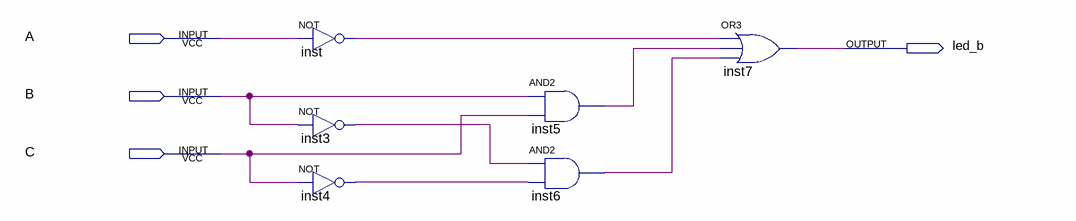
[diagram p0: schematic sheet]
// Quartus schematic led_b.bdf as structural Verilog: 6 symbols, 4 pins
module led_b (
  input  A,
  input  B,
  input  C,
  output led_b
);

  wire inst3_out, inst4_out, inst5_out, inst6_out, inst_out;

  not inst (inst_out, A);
  not inst3 (inst3_out, B);
  not inst4 (inst4_out, C);
  and inst5 (inst5_out, B, C);
  and inst6 (inst6_out, inst3_out, inst4_out);
  or inst7 (led_b, inst_out, inst5_out, inst6_out);
endmodule
